# EAGLE design untitled (EAGLE 6.2)
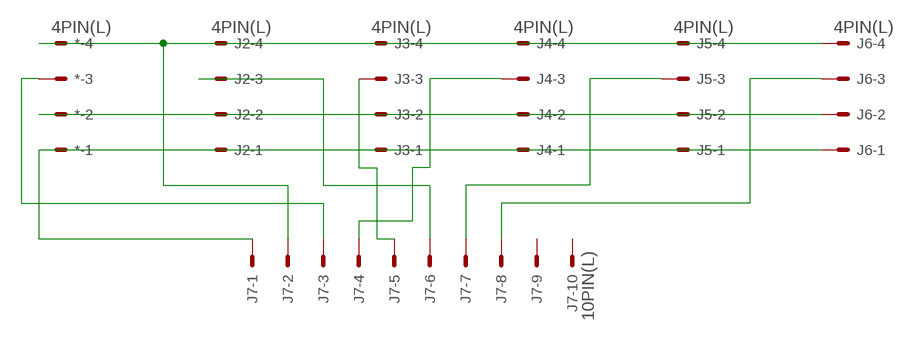
[diagram p0: schematic, sheet 1]

## Parts
*  4PIN(L)  [4PL]
J2  4PIN(L)  [4PL]
J3  4PIN(L)  [4PL]
J4  4PIN(L)  [4PL]
J5  4PIN(L)  [4PL]
J6  4PIN(L)  [4PL]
J7  10PIN(L)  [10PL]

## Nets
N$1: *.4 J2.4 J3.4 J4.4 J5.4 J6.4 J7.2
N$2: *.1 J2.1 J3.1 J4.1 J5.1 J6.1 J7.1
N$3: *.2 J2.2 J3.2 J4.2 J5.2 J6.2
N$4: *.3 J7.3
N$5: J2.3 J7.6
N$6: J3.3 J7.5
N$7: J4.3 J7.4
N$8: J5.3 J7.7
N$9: J6.3 J7.8
Unconnected: J7.9 J7.10

## Library data of the parts
* J2-J6 = my_connector:4PIN(L)
J7 = my_connector:10PIN(L)

## Board
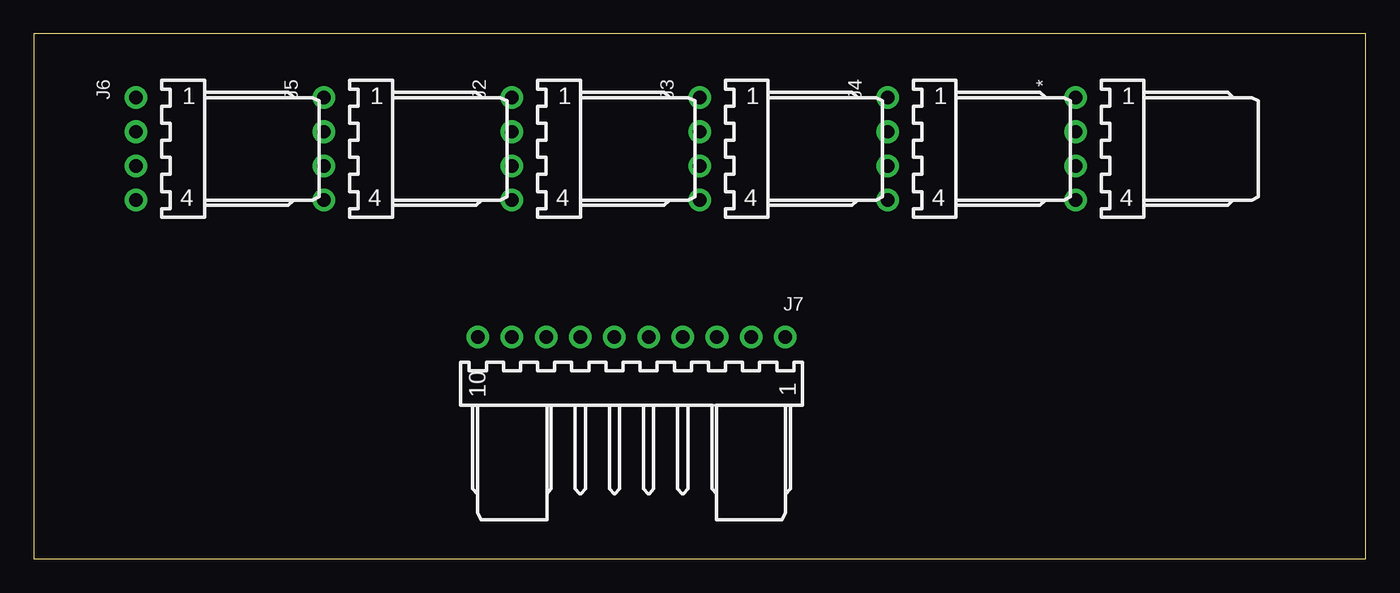
[diagram p1: board, top side]
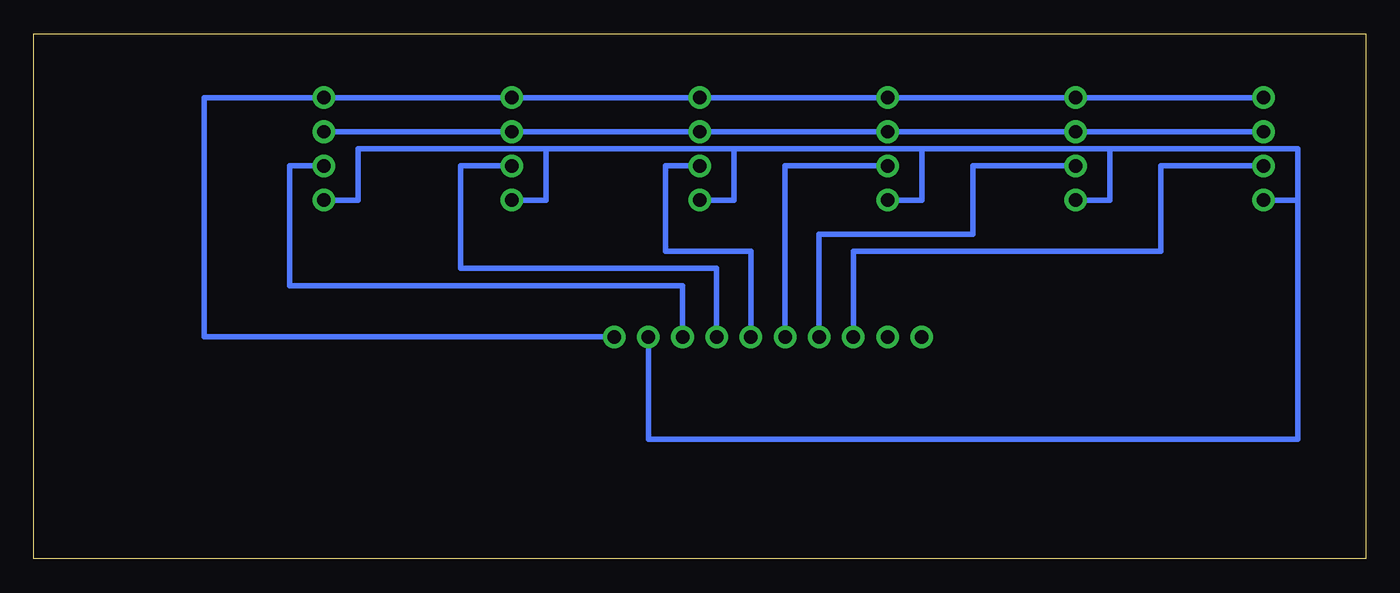
[diagram p2: board, bottom side, seen from below]

Size 99.04 x 39.04 mm. Coordinates in mm from the lower left corner, seen from the top.
Outline: 0,0 99.04,0 99.04,39.04 0,39.04 0,0
Copper layers (1*16): Top 0.035mm / dielectric 1.5mm / Bottom 0.035mm
Design rules: minimum track width 10mil, minimum drill 24mil, track to track 8mil, track to pad 8mil, pad to pad 8mil, via to via 8mil, smd to smd 8mil, copper to edge 40mil, drill to drill 8mil, minimum pad ring 10mil, minimum via ring 8mil, stop-mask expansion 4mil, vias tented up to drill 0mil, thermal gap 10mil

### Footprints (pad centres in the part's own frame; a part is rotated, then mirrored left to right if it is on the bottom)
4PL = drill 1 pad 1.676: 1 3.81,3.81; 2 1.27,3.81; 3 -1.27,3.81; 4 -3.81,3.81
10PL = drill 1 pad 1.676: 1 11.43,3.81; 2 8.89,3.81; 3 6.35,3.81; 4 3.81,3.81; 5 1.27,3.81; 6 -1.27,3.81; 7 -3.81,3.81; 8 -6.35,3.81; 9 -8.89,3.81; 10 -11.43,3.81

### Placement (x,y rotation side)
*  81.28,30.48 90 top
J2  39.37,30.48 90 top
J3  53.34,30.48 90 top
J4  67.31,30.48 90 top
J5  25.4,30.48 90 top
J6  11.43,30.48 90 top
J7  44.45,12.7 0 top

### Tracks (layer width: path | path; a pad name or v marks a point on that pad's centre or on a via)
N$1
  Bottom 0.406: J6.4 5.08,26.67 | 5.08,26.67 5.08,30.48 19.05,30.48 | 19.05,30.48 19.05,26.67 J5.4 | J2.4 33.02,26.67 33.02,30.48 | 33.02,30.48 19.05,30.48 | J3.4 46.99,26.67 46.99,30.48 | 46.99,30.48 33.02,30.48 | J4.4 60.96,26.67 60.96,30.48 | 60.96,30.48 46.99,30.48 | *.4 74.93,26.67 74.93,30.48 60.96,30.48 | J7.2 53.34,8.89 5.08,8.89 5.08,26.67
N$2
  Bottom 0.406: J6.1 J5.1 J2.1 J3.1 J4.1 *.1 86.36,34.29 86.36,16.51 J7.1
N$3
  Bottom 0.406: J6.2 J5.2 J2.2 J3.2 J4.2 *.2
N$4
  Bottom 0.406: *.3 80.01,29.21 80.01,20.32 50.8,20.32 J7.3
N$5
  Bottom 0.406: J2.3 43.18,29.21 J7.6
N$6
  Bottom 0.406: J3.3 52.07,29.21 52.07,22.86 45.72,22.86 J7.5
N$7
  Bottom 0.406: J4.3 67.31,29.21 67.31,21.59 48.26,21.59 J7.4
N$8
  Bottom 0.406: J7.7 40.64,24.13 29.21,24.13 29.21,29.21 J5.3
N$9
  Bottom 0.406: J6.3 15.24,29.21 15.24,22.86 38.1,22.86 J7.8